# EAGLE design Schema (EAGLE 7.7.0)
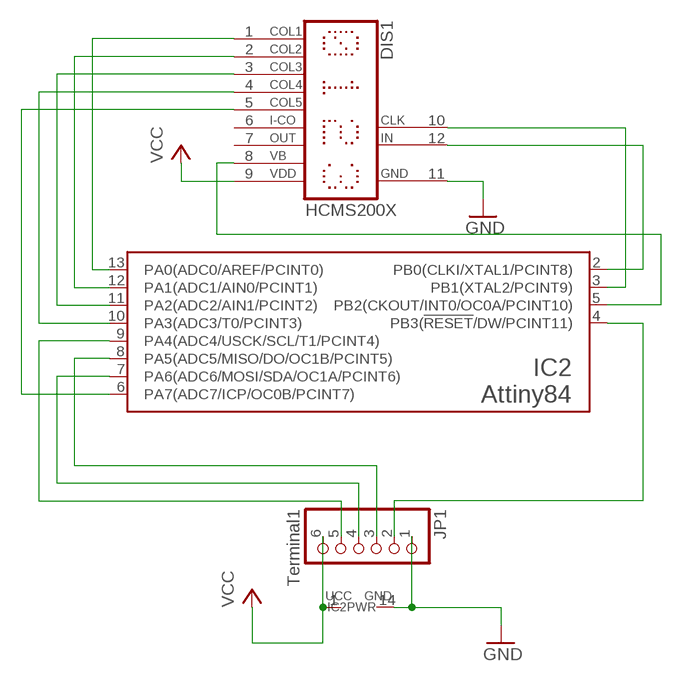
[diagram p0: schematic, sheet 1]

## Parts
DIS1  HCMS200X  [HCMS200X]
IC2  Attiny84  ATTINY24/44/84-PU  [DIL14]
JP1  Terminal1  PINHD-1X6  [1X06]

## Nets
GND: DIS1.11(GND) IC2.14(GND) JP1.1
N$1: DIS1.1(COL1) IC2.13(PA0(ADC0/AREF/PCINT0))
N$2: DIS1.2(COL2) IC2.12(PA1(ADC1/AIN0/PCINT1))
N$3: DIS1.3(COL3) IC2.11(PA2(ADC2/AIN1/PCINT2))
N$4: DIS1.4(COL4) IC2.10(PA3(ADC3/T0/PCINT3))
N$5: DIS1.5(COL5) IC2.6(PA7(ADC7/ICP/OC0B/PCINT7))
N$6: DIS1.12(IN) IC2.2(PB0(CLKI/XTAL1/PCINT8))
N$7: DIS1.10(CLK) IC2.3(PB1(XTAL2/PCINT9))
N$8: DIS1.8(VB) IC2.5(PB2(CKOUT/INT0/OC0A/PCINT10))
N$9: IC2.9(PA4(ADC4/USCK/SCL/T1/PCINT4)) JP1.5
N$10: IC2.4(PB3(!RESET!/DW/PCINT11)) JP1.2
N$11: IC2.7(PA6(ADC6/MOSI/SDA/OC1A/PCINT6)) JP1.4
N$12: IC2.8(PA5(ADC5/MISO/DO/OC1B/PCINT5)) JP1.3
VCC: DIS1.9(VDD) IC2.1(UCC) JP1.6
Unconnected: DIS1.6(I-CO) DIS1.7(OUT)

## Library data of the parts
DIS1 = display-hp:HCMS200X: LED DISPLAY 4-character dot matrix; OC_FARNELL: unknown; OC_NEWARK: unknown
IC2 = atmel_tiny24-44-84tiny48-88mega48-88-168-328:ATTINY24/44/84
JP1 = adafruit:PINHD-1X6: PIN HEADER

## Board
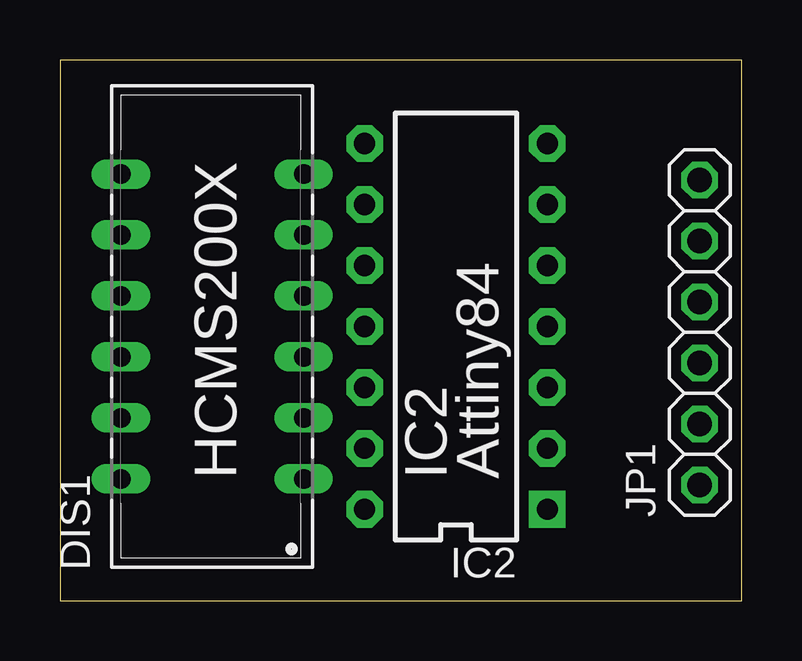
[diagram p1: board, top side]
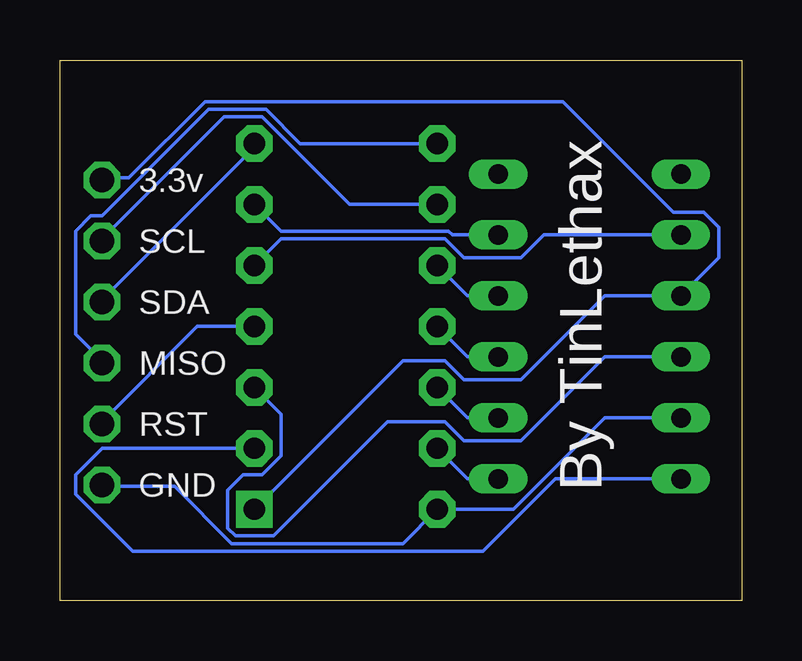
[diagram p2: board, bottom side, seen from below]

Size 28.43 x 22.53 mm. Coordinates in mm from the lower left corner, seen from the top.
Outline: 0,0 28.43,0 28.43,22.53 0,22.53 0,0
Copper layers (1*16): Top 0.035559375mm / dielectric 1.6mm / Bottom 0.035559375mm
Design rules "oshpark-2layer": minimum track width 6mil, minimum drill 10mil, track to track 6mil, track to pad 6mil, pad to pad 6mil, via to via 6mil, smd to smd 6mil, copper to edge 15mil, drill to drill 6mil, minimum pad ring 5mil, minimum via ring 5mil, stop-mask expansion 2.5mil, vias tented up to drill 0mil, thermal gap 10mil

### Footprints (pad centres in the part's own frame; a part is rotated, then mirrored left to right if it is on the bottom)
HCMS200X = drill 0.813 long: 1 -6.35,-3.81; 2 -3.81,-3.81; 3 -1.27,-3.81; 4 1.27,-3.81; 5 3.81,-3.81; 6 6.35,-3.81; 7 6.35,3.81; 8 3.81,3.81; 9 1.27,3.81; 10 -1.27,3.81; 11 -3.81,3.81; 12 -6.35,3.81
DIL14 = drill 0.889 pad 1.524 square: 1 -7.62,-3.81 | drill 0.889 pad 1.524 octagon: 2 -5.08,-3.81; 3 -2.54,-3.81; 4 0,-3.81; 5 2.54,-3.81; 6 5.08,-3.81; 7 7.62,-3.81; 8 7.62,3.81; 9 5.08,3.81; 10 2.54,3.81; 11 0,3.81; 12 -2.54,3.81; 13 -5.08,3.81; 14 -7.62,3.81
1X06 = drill 1.016 octagon: 1 -6.35,0; 2 -3.81,0; 3 -1.27,0; 4 1.27,0; 5 3.81,0; 6 6.35,0

### Placement (x,y rotation side)
DIS1  6.35,11.43 90 top
IC2  16.51,11.43 90 top
JP1  26.67,11.18 90 top

### Tracks (layer width: path | path; a pad name or v marks a point on that pad's centre or on a via)
GND
  Bottom 0.152: DIS1.11 5.71,7.62 9.53,3.81 IC2.14 14.13,2.38 21.27,2.38 23.65,4.76 26.67,4.76 JP1.1
N$1
  Bottom 0.152: DIS1.1 11.43,5.08 IC2.13
N$2
  Bottom 0.152: DIS1.2 11.43,7.62 IC2.12
N$3
  Bottom 0.152: DIS1.3 11.43,10.16 IC2.11
N$4
  Bottom 0.152: DIS1.4 11.43,12.7 IC2.10
N$5
  Bottom 0.152: DIS1.5 12.06,15.24 12.22,15.4 19.21,15.4 IC2.6
N$6
  Bottom 0.152: DIS1.12 7.78,5.08 10.79,2.06 25.4,2.06 27.78,4.45 27.78,5.24 26.67,6.35 IC2.2
N$7
  Bottom 0.152: DIS1.10 5.71,10.16 9.21,6.67 11.59,6.67 12.38,7.46 14.76,7.46 19.53,2.7 21.11,2.7 21.43,3.02 21.43,4.6 20.8,5.24 20,5.24 19.21,6.03 19.21,7.78 IC2.3
N$8
  Bottom 0.152: DIS1.8 8.26,15.24 9.21,14.29 11.59,14.29 12.38,15.08 19.21,15.08 IC2.5
N$9
  Bottom 0.152: IC2.9 16.35,16.51 20,20.16 21.59,20.16 26.67,15.08 JP1.5
N$10
  Bottom 0.152: IC2.4 22.7,11.43 26.67,7.46 JP1.2
N$11
  Bottom 0.152: IC2.7 20.32,18.89 26.67,12.54 JP1.4
N$12
  Bottom 0.152: IC2.8 18.41,19.05 19.84,20.48 22.23,20.48 26.67,16.03 27.15,16.03 27.78,15.4 27.78,11.11 26.67,10 JP1.3
VCC
  Bottom 0.152: IC2.1 14.13,10 12.38,10 11.59,9.21 9.21,9.21 5.71,12.7 DIS1.9 0.95,14.29 0.95,15.56 1.59,16.19 2.86,16.19 7.46,20.8 22.38,20.8 25.56,17.62 26.67,17.62 JP1.6

### Text on the board
tPlace: HCMS200X | Attiny84
bPlace: 3.3v | SCL | SDA | MISO | RST | By TinLethax | GND